# Altium schematic sheet beaglebone.SchDoc
size A; SheetNumber: 1; SheetTotal: 3
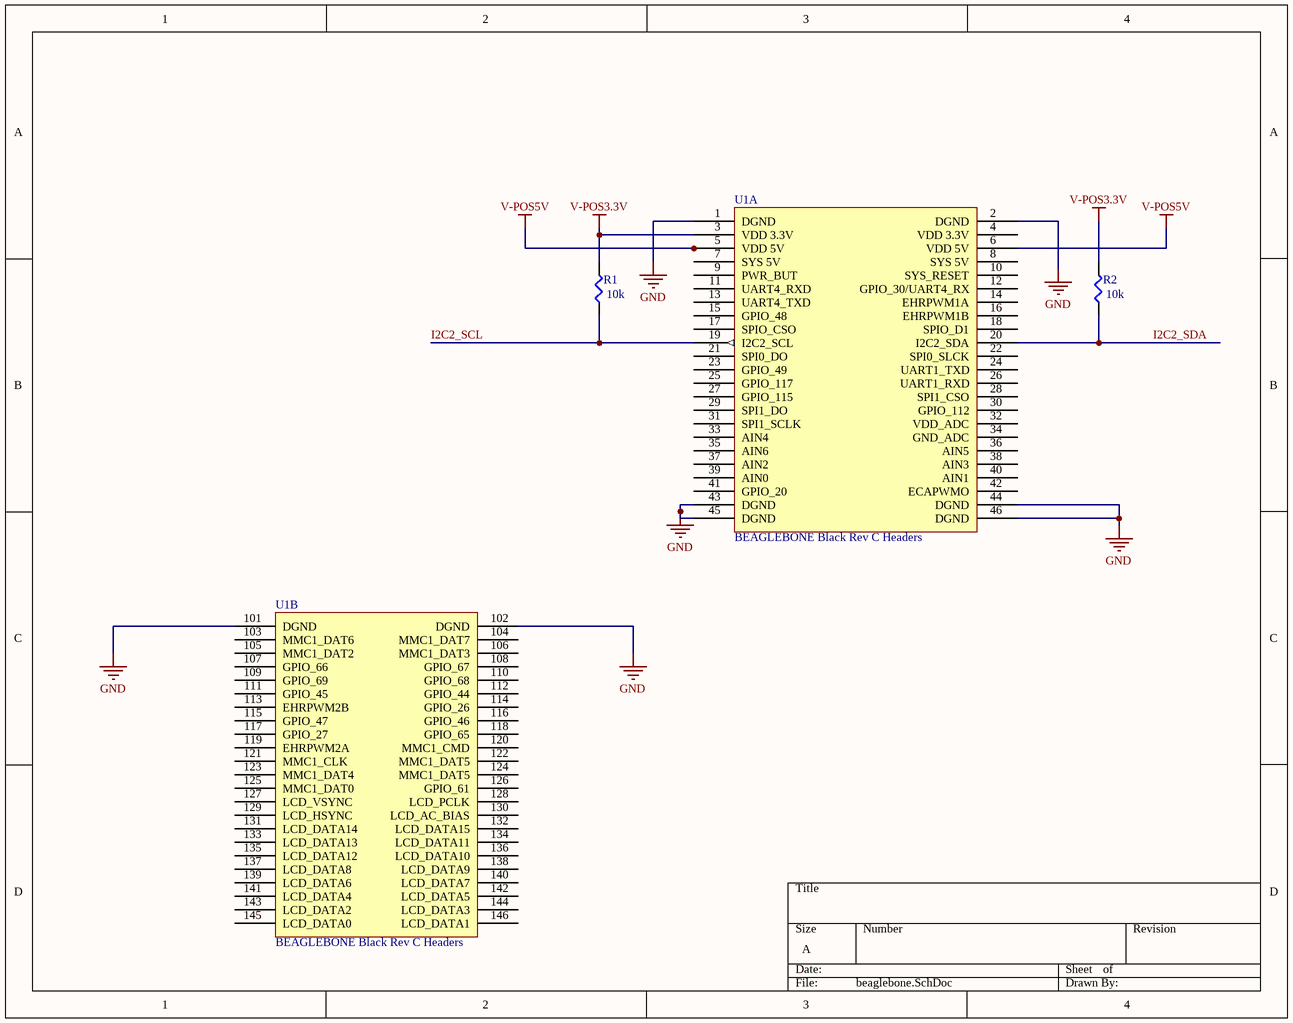
[diagram p0: beaglebone.SchDoc]

## Parts
R1  10k  [SMD-0805-RES]
R2  10k  [SMD-0805-RES]
U1  BEAGLEBONE Black Rev C Headers  [Beaglebone_Topside]  (parts A,B of 2)

## Nets
GND: U1.1(DGND) U1.2(DGND) U1.43(DGND) U1.44(DGND) U1.45(DGND) U1.46(DGND) U1.101(DGND) U1.102(DGND)
V-POS3.3V: R1.2 R2.2 U1.3(VDD_3.3V)
V-POS5V: U1.5(VDD_5V) U1.6(VDD_5V)
I2C2_SCL: R1.1 U1.19(I2C2_SCL)
I2C2_SDA: R2.1 U1.20(I2C2_SDA)

Not connected (* = marked no-connect by the designer): U1 4(VDD_3.3V) 7(SYS_5V) 8(SYS_5V) 9(PWR_BUT) 10(SYS_RESET) 11(UART4_RXD) 12(GPIO_30/UART4_RX) 13(UART4_TXD) 14(EHRPWM1A) 15(GPIO_48) 16(EHRPWM1B) 17(SPIO_CSO) 18(SPIO_D1) 21(SPI0_DO) 22(SPI0_SLCK) 23(GPIO_49) 24(UART1_TXD) 25(GPIO_117) 26(UART1_RXD) 27(GPIO_115) 28(SPI1_CSO) 29(SPI1_DO) 30(GPIO_112) 31(SPI1_SCLK) 32(VDD_ADC) 33(AIN4) 34(GND_ADC) 35(AIN6) 36(AIN5) 37(AIN2) 38(AIN3) 39(AIN0) 40(AIN1) 41(GPIO_20) 42(ECAPWMO) 103(MMC1_DAT6) 104(MMC1_DAT7) 105(MMC1_DAT2) 106(MMC1_DAT3) 107(GPIO_66) 108(GPIO_67) 109(GPIO_69) 110(GPIO_68) 111(GPIO_45) 112(GPIO_44) 113(EHRPWM2B) 114(GPIO_26) 115(GPIO_47) 116(GPIO_46) 117(GPIO_27) 118(GPIO_65) 119(EHRPWM2A) 120(MMC1_CMD) 121(MMC1_CLK) 122(MMC1_DAT5) 123(MMC1_DAT4) 124(MMC1_DAT5) 125(MMC1_DAT0) 126(GPIO_61) 127(LCD_VSYNC) 128(LCD_PCLK) 129(LCD_HSYNC) 130(LCD_AC_BIAS) 131(LCD_DATA14) 132(LCD_DATA15) 133(LCD_DATA13) 134(LCD_DATA11) 135(LCD_DATA12) 136(LCD_DATA10) 137(LCD_DATA8) 138(LCD_DATA9) 139(LCD_DATA6) 140(LCD_DATA7) 141(LCD_DATA4) 142(LCD_DATA5) 143(LCD_DATA2) 144(LCD_DATA3) 145(LCD_DATA0) 146(LCD_DATA1)

## Library data of the parts
R1 R2 = ERJ-6ENF1002V: RES SMD 10K OHM 1% 1/8W 0805; Manufacturer: Panasonic Electronic Components; Factory Stock: 0; Unit Price (USD): 0.00729; @ qty: 1500; Minimum Quantity: 1; Power (Watts): 0.125W, 1/8W; Temperature Coefficient: ±100ppm/°C; Part Number: ERJ-6ENF1002V; Datasheets: http://industrial.panasonic.com/www-cgi/jvcr13pz.cgi?E+PZ+3+AOA0002+ERJ6ENF1002V+7+WW; Image: //media.digikey.com/Renders/Panasonic%20Renders/ERJ-0805%20Pkg.jpg; Digi-Key Part Number: P10.0KCCT-ND; Quantity Available: 3985614; Packaging: Cut Tape (CT); Series: ERJ; Part Status: Active; Value: 10k; Tolerance: ±1%; Composition: Thick Film; Features: Automotive AEC-Q200; Operating Temperature: -55°C ~ 155°C; Package / Case: 0805 (2012 Metric); Supplier Device Package: 0805; Size / Dimension: 0.079" L x 0.049" W (2.00mm x 1.25mm); Height - Seated (Max): 0.028" (0.70mm); Number of Terminations: 2; Failure Rate: -
U1 = Beaglebone: KIT DEV BEAGLEBONE BLACK REV C. Header Breakout; Manufactuer: Beaglebone; Manufacturer P/N: Beaglebone Black REV C; Digikey P/N: BBB01-SC-505-ND; Digikey Link: https://www.digikey.com/product-detail/en/ghi-electronics-llc/BBB01-SC-505/BBB01-SC-505-ND/6210999; Datasheet: https://media.digikey.com/pdf/Data%20Sheets/Circuitco%20Elect/BB-BBLK-000%20Manual.pdf; ComponentLink1Description: Digikey; ComponentLink1URL: https://www.digikey.com/product-detail/en/ghi-electronics-llc/BBB01-SC-505/BBB01-SC-505-ND/6210999